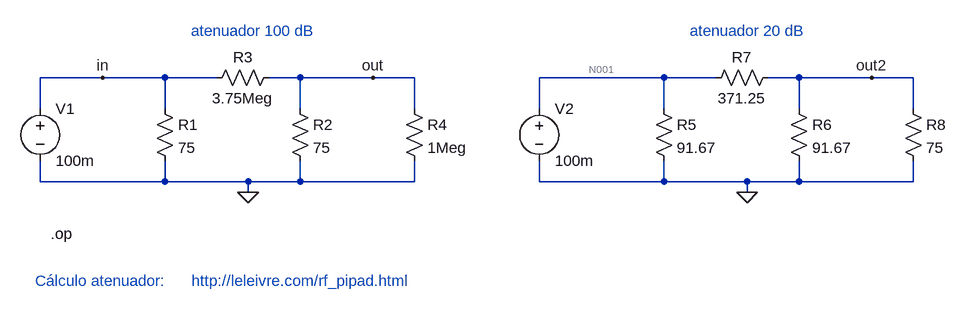
[diagram p0: schematic atenuador_pi.asc]
atenuador_pi.asc, the LTspice schematic file:
Version 4
SHEET 1 1320 680
WIRE 16 96 -80 96
WIRE 112 96 16 96
WIRE 192 96 112 96
WIRE 320 96 272 96
WIRE 432 96 320 96
WIRE 496 96 432 96
WIRE 880 96 688 96
WIRE 960 96 880 96
WIRE 1088 96 1040 96
WIRE 1200 96 1088 96
WIRE 1264 96 1200 96
WIRE -80 144 -80 96
WIRE 112 144 112 96
WIRE 320 144 320 96
WIRE 496 144 496 96
WIRE 688 144 688 96
WIRE 880 144 880 96
WIRE 1088 144 1088 96
WIRE 1264 144 1264 96
WIRE -80 256 -80 224
WIRE 112 256 112 224
WIRE 112 256 -80 256
WIRE 240 256 112 256
WIRE 320 256 320 224
WIRE 320 256 240 256
WIRE 496 256 496 224
WIRE 496 256 320 256
WIRE 688 256 688 224
WIRE 880 256 880 224
WIRE 880 256 688 256
WIRE 1008 256 880 256
WIRE 1088 256 1088 224
WIRE 1088 256 1008 256
WIRE 1264 256 1264 224
WIRE 1264 256 1088 256
WIRE 240 272 240 256
WIRE 1008 272 1008 256
FLAG 240 272 0
FLAG 432 96 out
FLAG 16 96 in
FLAG 1008 272 0
FLAG 1200 96 out2
SYMBOL res 96 128 R0
SYMATTR InstName R1
SYMATTR Value 75
SYMBOL res 304 128 R0
SYMATTR InstName R2
SYMATTR Value 75
SYMBOL res 288 80 R90
WINDOW 0 0 56 VBottom 2
WINDOW 3 32 56 VTop 2
SYMATTR InstName R3
SYMATTR Value 3.75Meg
SYMBOL res 480 128 R0
SYMATTR InstName R4
SYMATTR Value 1Meg
SYMBOL voltage -80 128 R0
WINDOW 123 0 0 Left 2
WINDOW 39 0 0 Left 2
SYMATTR InstName V1
SYMATTR Value 100m
SYMBOL res 864 128 R0
SYMATTR InstName R5
SYMATTR Value 91.67
SYMBOL res 1072 128 R0
SYMATTR InstName R6
SYMATTR Value 91.67
SYMBOL res 1056 80 R90
WINDOW 0 0 56 VBottom 2
WINDOW 3 32 56 VTop 2
SYMATTR InstName R7
SYMATTR Value 371.25
SYMBOL res 1248 128 R0
SYMATTR InstName R8
SYMATTR Value 75
SYMBOL voltage 688 128 R0
WINDOW 123 0 0 Left 2
WINDOW 39 0 0 Left 2
SYMATTR InstName V2
SYMATTR Value 100m
TEXT -88 408 Left 2 ;Cálculo atenuador:      http://leleivre.com/rf_pipad.html
TEXT -64 336 Left 2 !.op
TEXT 152 24 Left 2 ;atenuador 100 dB
TEXT 920 24 Left 2 ;atenuador 20 dB

The netlist it stands for:
* atenuador_pi.asc
R1 in 0 75
R2 out 0 75
R3 out in 3.75Meg
R4 out 0 1Meg
V1 in 0 100m
R5 N001 0 91.67
R6 out2 0 91.67
R7 out2 N001 371.25
R8 out2 0 75
V2 N001 0 100m
* Cálculo atenuador:      http://leleivre.com/rf_pipad.html
.op
* atenuador 100 dB
* atenuador 20 dB
.backanno
.end

* Results of the author's LTspice run, read from the files saved beside the schematic
* Operating Point:
*   V(in) = 100 mV
*   V(out) = 2 µV
*   V(n001) = 100 mV
*   V(out2) = 10 mV
*   I(R8) = 133.3 µA
*   I(R7) = -242.4 µA
*   I(R6) = 109.1 µA
*   I(R5) = 1.091 mA
*   I(R4) = 2 pA
*   I(R3) = -26.67 nA
*   I(R2) = 26.66 nA
*   I(R1) = 1.333 mA
*   I(V2) = -1.333 mA
*   I(V1) = -1.333 mA